# Altium schematic sheet uC.SchDoc: Buck Sinc Converter
size A4; Organization: UDESC; Revision: R0; SheetNumber: 8; SheetTotal: 10
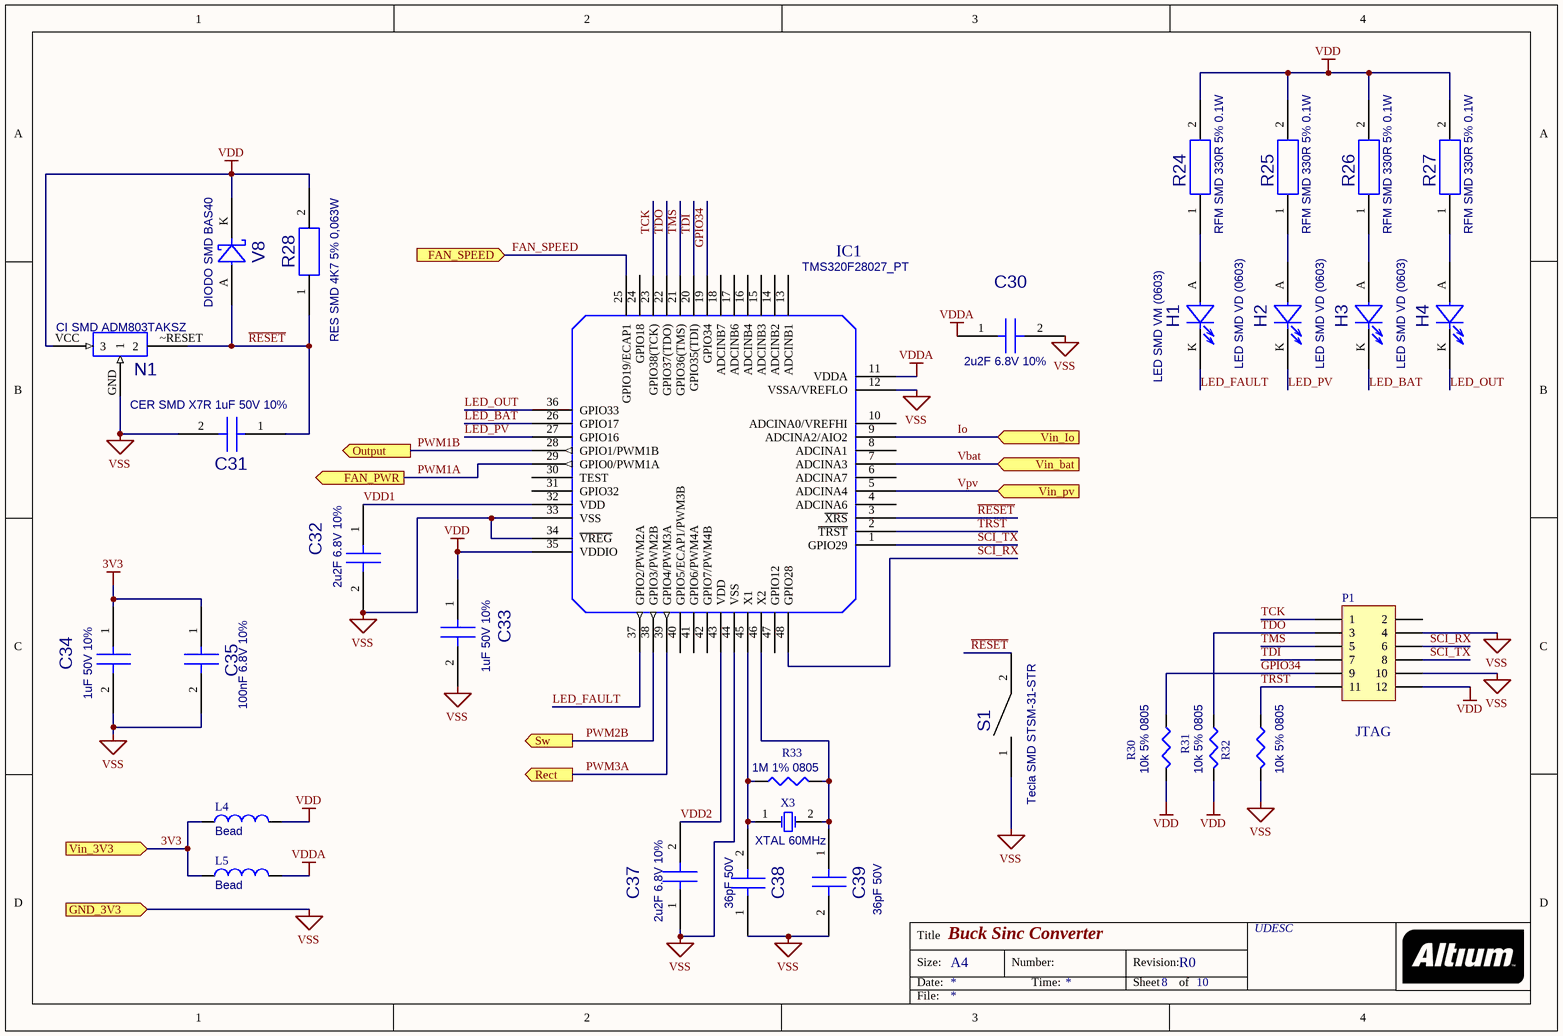
[diagram p0: uC.SchDoc]

## Parts
C30  2u2F 6.8V 10%  [C0805_R_V0]
C31  value CER SMD X7R 1uF 50V 10%  [C0805_R_V0]  (hidden comment: 11736520)
C32  2u2F 6.8V 10%  [C0805_R_V0]
C33  1uF 50V 10%  [C0805_R_V0]
C34  1uF 50V 10%  [C0805_R_V0]
C35  100nF 6.8V 10%  [C0805_R_V0]
C37  2u2F 6.8V 10%  [C0805_R_V0]
C38  36pF 50V  [C0805_R_V0]
C39  36pF 50V  [C0805_R_V0]
H1  value LED SMD VM (0603)  [LED 0603_12133537(Primary)]  (hidden comment: 12133537)
H2  value LED SMD VD (0603)  [LED 0603_12133535(Primary)]  (hidden comment: 12133535)
H3  value LED SMD VD (0603)  [LED 0603_12133535(Primary)]  (hidden comment: 12133535)
H4  value LED SMD VD (0603)  [LED 0603_12133535(Primary)]  (hidden comment: 12133535)
IC1  TMS320F28027_PT  [LQFP48]
L4  value Bead  [R0805_R_V0]  (hidden comment: Inductor)
L5  value Bead  [R0805_R_V0]  (hidden comment: Inductor)
N1  value CI SMD ADM803TAKSZ  [SC70A]  (hidden comment: 10050567)
P1  Header 6X2  [HDR2X6]  (value not drawn)
R24  value RFM SMD 330R 5% 0.1W  [R0805_R_V0]  (hidden comment: 10191962)
R25  value RFM SMD 330R 5% 0.1W  [R0805_R_V0]  (hidden comment: 10191962)
R26  value RFM SMD 330R 5% 0.1W  [R0805_R_V0]  (hidden comment: 10191962)
R27  value RFM SMD 330R 5% 0.1W  [R0805_R_V0]  (hidden comment: 10191962)
R28  value RES SMD 4K7 5% 0,063W  [R0805_R_V0]  (hidden comment: 11417855)
R30  value 10k 5% 0805  [R0805_R_V0]  (hidden comment: 1k 5% 0805)
R31  value 10k 5% 0805  [R0805_R_V0]  (hidden comment: 1k 5% 0805)
R32  value 10k 5% 0805  [R0805_R_V0]  (hidden comment: 1k 5% 0805)
R33  1M 1% 0805  [R0805_R_V0]
S1  value Tecla SMD STSM-31-STR  [TECLA STSM BOURNS]  (hidden comment: 10050610)
V8  value DIODO SMD BAS40  [SOT23A]  (hidden comment: 10192124)
X3  XTAL 60MHz  [XTAL  CSTCE_G_A]

## Ports
FAN_PWR (out), FAN_SPEED (in), GND_3V3 (in), Output (out), Rect (out), Sw (out), Vin_3V3 (in), Vin_bat (in), Vin_Io (in), Vin_pv (in)

## Nets
3V3: C34.1 C35.1 L4.1 L5.2 ; port Vin_3V3
VDD: C33.1 IC1.35(VDDIO) L4.2 N1.VCC(3) P1.12 R24.2 R25.2 R26.2 R27.2 R28.2 R30.2 R31.2 V8.K
VDDA: C30.1 IC1.11(VDDA) L5.1
VSS: C30.2 C31.2 C32.2 C33.2 C34.2 C35.2 C37.1 C38.1 C39.2 IC1.12(VSSA/VREFLO) IC1.33(VSS) IC1.34(~{VREG}) IC1.44(VSS) N1.GND(1) P1.4 P1.10 R32.2 S1.1 ; port GND_3V3
~{RESET}: C31.1 IC1.3(~{XRS}) N1.~RESET(2) R28.1 S1.2 V8.A
FAN_SPEED: IC1.25(GPIO19/ECAP1) ; port FAN_SPEED
GPIO34: IC1.19(GPIO34) P1.9 R30.1
Io: IC1.9(ADCINA2/AIO2) ; port Vin_Io
LED_BAT: H3.K IC1.26(GPIO17)
LED_FAULT: H1.K IC1.37(GPIO2/PWM2A)
LED_OUT: H4.K IC1.36(GPIO33)
LED_PV: H2.K IC1.27(GPIO16)
PWM1A: IC1.29(GPIO0/PWM1A) ; port FAN_PWR
PWM1B: IC1.28(GPIO1/PWM1B) ; port Output
PWM2B: IC1.38(GPIO3/PWM2B) ; port Sw
PWM3A: IC1.39(GPIO4/PWM3A) ; port Rect
SCI_RX: IC1.48(GPIO28) P1.6
SCI_TX: IC1.1(GPIO29) P1.8
TCK: IC1.23(GPIO38(TCK)) P1.1
TDI: IC1.20(GPIO35(TDI)) P1.7
TDO: IC1.22(GPIO37(TDO)) P1.3 R31.1
TMS: IC1.21(GPIO36(TMS)) P1.5
TRST: IC1.2(~{TRST}) P1.11 R32.1
Vbat: IC1.7(ADCINA3) ; port Vin_bat
VDD1: C32.1 IC1.32(VDD)
VDD2: C37.2 IC1.43(VDD)
Vpv: IC1.5(ADCINA4) ; port Vin_pv
NetC38_2: C38.2 IC1.45(X1) R33.1 X3.1(OSC1)
NetC39_1: C39.1 IC1.46(X2) R33.2 X3.2(OSC2)
NetH1_A: H1.A R24.1
NetH2_A: H2.A R25.1
NetH3_A: H3.A R26.1
NetH4_A: H4.A R27.1

Not connected (* = marked no-connect by the designer): IC1 4(ADCINA6) 6(ADCINA7) 8(ADCINA1) 10(ADCINA0/VREFHI) 13(ADCINB1) 14(ADCINB2) 15(ADCINB3) 16(ADCINB4) 17(ADCINB6) 18(ADCINB7) 24(GPIO18) 30(TEST) 31(GPIO32) 40(GPIO5/ECAP1/PWM3B) 41(GPIO6/PWM4A) 42(GPIO7/PWM4B) 47(GPIO12); P1 2; V8 NC

## Notes on the sheet
- (near P1) JTAG
- Title
- Size:
- Date:
- A4
- Number:
- Time:
- Revision:
- Sheet
- of
- File:

## Library data of the parts
C30 C32 C37 = 11736520: CER SMD X7R 1uF 50V 10%; HISsym: Atualizado em 12/07/05; PN: 10192095; HISitem: Criado em 15/04/11 (p/ Sandro W.); PMT: SMD; Value: 2u2F 6.8V 10%
C31 C33 C34 = 11736520: CER SMD X7R 1uF 50V 10%; HISsym: Atualizado em 12/07/05; HISitem: Criado em 15/04/11 (p/ Sandro W.); PN: 11736520; PMT: SMD
  C33 C34: Value: 1uF 50V 10%
C35 = 11736520: CER SMD X7R 1uF 50V 10%; HISsym: Atualizado em 12/07/05; PN: 10192075; HISitem: Criado em 15/04/11 (p/ Sandro W.); PMT: SMD; Value: 100nF 6.8V 10%
C38 C39 = 11736520: CER SMD C0G 36pF 50V; HISsym: Atualizado em 12/07/05; HISitem: Criado em 15/04/11 (p/ Sandro W.); PN: 11736520; PMT: SMD; Value: 36pF 50V
H1 = 12133537: LED SMD VM (0603); HISitem: Criado em 31/08/11 (p/ Ricardo); PN: 12133537; PMT: SMD
H2-H4 = 12133535: LED SMD VD (0603); HISitem: Criado em 31/08/11 (p/ Ricardo); PN: 12133535; PMT: SMD
IC1 = TMS320F28027_PT: LQFP48; EECON Code: XXX; Text Field 1: TEXAS; Componente: DSX LQFP48; Text Field: TMS320F28027_PT; DES: XXX; Value: TMS320F28027_PT
L4 L5 = Inductor: Code_IEC: 1005; PN: 12436892; Published: 8-Jun-2000; LatestRevisionDate: 29-May-2009; LatestRevisionNote: IPC-7351 Footprint Added.; PackageReference: 0402-A; Publisher: Altium Limited; PackageDescription: Chip Inductor; Code_JEITA: 0402
N1 = 10050567: CI SMD ADM803TAKSZ; HISsym: Atualizado em 16/08/05; HISitem: Alterado encaps. para SC70 em 16/08/05; PN: 10050567; PMT: SMD
P1 = Header 6X2: Header, 6-Pin, Dual row; LatestRevisionDate: 17-Jul-2002; LatestRevisionNote: Re-released for DXP Platform.; Publisher: Altium Limited
R24-R27 = 10191962: RFM SMD 330R 5% 0.1W; HISsym: Atualizado em 20/07/05; PN: 10191962; PMT: SMD
R28 = 11417855: RES SMD 4K7 5% 0,063W; HISsym: Atualizado em 20/07/05; HISitem: Criado em 23/04/10 (p/ Ricardo); PN: 11417855; PMT: SMD
R30-R32 = Res3_2: Resistor; PN: 10192008; PMT: SMD; Published: 8-Jun-2000; LatestRevisionDate: 29-May-2009; LatestRevisionNote: IPC-7351 Footprint Added.; PackageReference: J1-0603; Publisher: Altium Limited; PackageDescription: Chip Resistor
R33 = Res3_2: Resistor; PN: 10118079; PMT: SMD; Published: 8-Jun-2000; LatestRevisionDate: 29-May-2009; LatestRevisionNote: IPC-7351 Footprint Added.; PackageReference: J1-0603; Publisher: Altium Limited; PackageDescription: Chip Resistor; Value: 1M 1% 0805
S1 = 10050610: Tecla SMD STSM-31-STR; NUMBER PIN: 02; PN: 10050610; PMT: SMD
V8 = 10192124: DIODO SMD BAS40; HISsym: Atualizado em 10/07/06; NUMBER PIN: 02; PN: 10192124; PMT: SMD
X3 = XTAL: Crystal Oscillator; PMT: SMD; Published: 8-Jun-2000; LatestRevisionDate: 17-Jul-2002; LatestRevisionNote: Re-released for DXP Platform.; PackageReference: R38; Publisher: Altium Limited; Value: XTAL 60MHz